# Altium project cree_module.PrjPcb
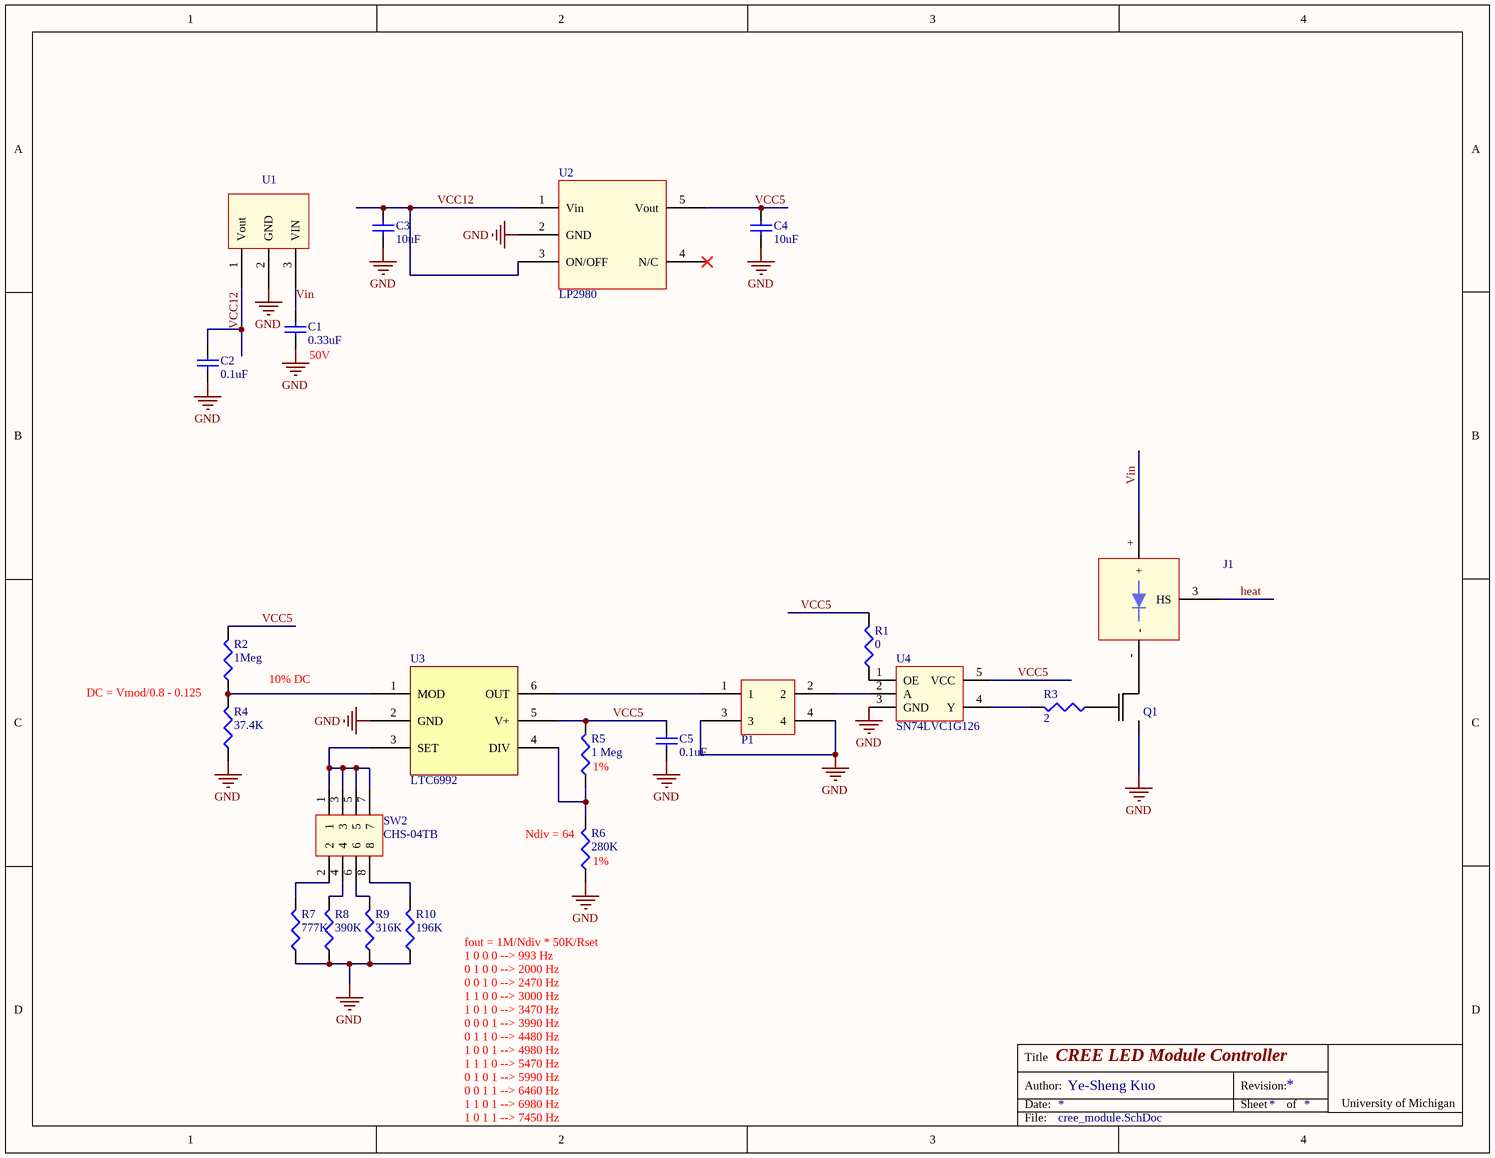
[diagram p0: cree_module.SchDoc]
1 sheet, 23 parts. Net scope: global (net labels, ports and power ports of the same name join across sheets).
Board files: cree.PcbDoc, cree_module_v2.PcbDoc, cree_mobicom.PcbDoc

## Sheet cree_module.SchDoc: CREE LED Module Controller
size Letter; Author: Ye-Sheng Kuo

### Parts
C1  value 0.33uF  [1608[0603]]  (hidden comment: Cap Semi)
C2  value 0.1uF  [1608[0603]]  (hidden comment: Cap Semi)
C3  value 10uF  [1608[0603]]  (hidden comment: Cap Semi)
C4  value 10uF  [1608[0603]]  (hidden comment: Cap Semi)
C5  value 0.1uF  [1608[0603]]  (hidden comment: Cap Semi)
J1  1807200002  [molex]  (value not drawn)
P1  2 x 2 header SMD  [2x2 header SMD]  (value not drawn)
Q1  Si2312CDS  [SOT95P250-3N]  (value not drawn)
R1  value 0  [J1-0603]  (hidden comment: Res3)
R2  value 1Meg  [J1-0603]  (hidden comment: Res3)
R3  value 2  [J1-0603]  (hidden comment: Res3)
R4  value 37.4K  [J1-0603]  (hidden comment: Res3)
R5  value 1 Meg  [J1-0603]  (hidden comment: Res3)
R6  value 280K  [J1-0603]  (hidden comment: Res3)
R7  value 777K  [6-0805_N]  (hidden comment: Res3)
R8  value 390K  [6-0805_N]  (hidden comment: Res3)
R9  value 316K  [6-0805_N]  (hidden comment: Res3)
R10  value 196K  [6-0805_N]  (hidden comment: Res3)
SW2  CHS-04TB  [CHS04TB]
U1  L78L  [SOT89-150P409X160-3N]  (value not drawn)
U2  LP2980  [SOT23-5]
U3  LTC6992  [TSOT23-6]
U4  SN74LVC1G126  [SOT23-5]

### Nets
GND: C1.1 C2.1 C3.1 C4.1 C5.1 P1.3 P1.4 Q1.2(S) R4.1 R6.1 R7.1 R8.1 R9.1 R10.1 U1.2(GND) U2.2(GND) U3.2(GND) U4.3(GND)
heat: J1.3(HS)
VCC5: C4.2 C5.2 R1.2 R2.2 R5.2 U2.5(Vout) U3.5(V+) U4.5(VCC)
VCC12: C2.2 C3.2 U1.1(Vout) U2.1(Vin) U2.3(ON/OFF)
Vin: C1.2 J1.+ U1.3(VIN)
NetJ1_-: J1.- Q1.3(D)
NetP1_1: P1.1 U3.6(OUT)
NetP1_2: P1.2 U4.2(A)
NetQ1_1: Q1.1(G) R3.1
NetR1_1: R1.1 U4.1(OE)
NetR2_1: R2.1 R4.2 U3.1(MOD)
NetR3_2: R3.2 U4.4(Y)
NetR5_1: R5.1 R6.2 U3.4(DIV)
NetR7_2: R7.2 SW2.2
NetR8_2: R8.2 SW2.4
NetR9_2: R9.2 SW2.6
NetR10_2: R10.2 SW2.8
NetSW2_1: SW2.1 SW2.3 SW2.5 SW2.7 U3.3(SET)

Not connected (* = marked no-connect by the designer): U2 4(N/C)*

### Notes on the sheet
- (near C1) 50V
- DC = Vmod/0.8 - 0.125
- 10% DC
- (near R5) 1%
- (near R6) Ndiv = 64
- (near R6) 1%
- fout = 1M/Ndiv * 50K/Rset
- 1 0 0 0 --> 993 Hz
- 0 1 0 0 --> 2000 Hz
- 0 0 1 0 --> 2470 Hz
- 1 1 0 0 --> 3000 Hz
- 1 0 1 0 --> 3470 Hz
- 0 0 0 1 --> 3990 Hz
- 0 1 1 0 --> 4480 Hz
- 1 0 0 1 --> 4980 Hz
- 1 1 1 0 --> 5470 Hz
- 0 1 0 1 --> 5990 Hz
- 0 0 1 1 --> 6460 Hz
- 1 1 0 1 --> 6980 Hz
- 1 0 1 1 --> 7450 Hz
- Title
- Date:
- Author:
- Revision:
- Sheet
- of
- University of Michigan
- File:

### Library data of the parts
C1-C5 = Cap Semi: Capacitor (Semiconductor SIM Model); Published: 8-Jun-2000; LatestRevisionDate: 29-May-2009; LatestRevisionNote: IPC-7351 Footprint Added.; PackageReference: C1206; Publisher: Altium Limited; PackageDescription: Chip Capacitor
J1 = Molex LED holder: LED Array Holders  for CREE* XLamp†   Arrays; Supplier 1: Digi-Key; Supplier Part Number 1: WM10352-ND
P1 = 2 x 2 header SMD: 2x2 100 mil header SMD; Supplier 1: Digi-Key; Supplier Part Number 1: 609-4463-6-ND
Q1 = Si2312CDS: N-Channel 20 V (D-S) MOSFET; Supplier 1: Digi-Key; Supplier Part Number 1: SI2312CDS-T1-GE3DKR-ND
R1-R10 = Res3: Resistor; Published: 8-Jun-2000; LatestRevisionDate: 29-May-2009; LatestRevisionNote: IPC-7351 Footprint Added.; PackageReference: J1-0603; Publisher: Altium Limited; PackageDescription: Chip Resistor
SW2 = CHS-04TB: SLIDE SWITCHES
U1 = L78L: Positive voltage regulators; Supplier 1: Digi-Key; Supplier Part Number 1: 497-1195-2-ND
U2 = LP2980-N: LP2980-N Micropower 50 mA Ultra Low-Dropout Regulator In SOT-23 Package; Supplier 1: Digi-Key; Supplier Part Number 1: LP2980AIM5-2.5/NOPBCT-ND
U3 = LTC6992: TimerBlox: Voltage-Controlled Pulse   Width Modulator (PWM); Supplier 1: Digi-Key; Supplier Part Number 1: LTC6992CS6-1#TRMPBFTR-ND
U4 = SN74LVC1G126: Single Bus Buffer Gate With 3-State Output; Supplier 1: Digi-Key; Supplier Part Number 1: 296-11605-1-ND